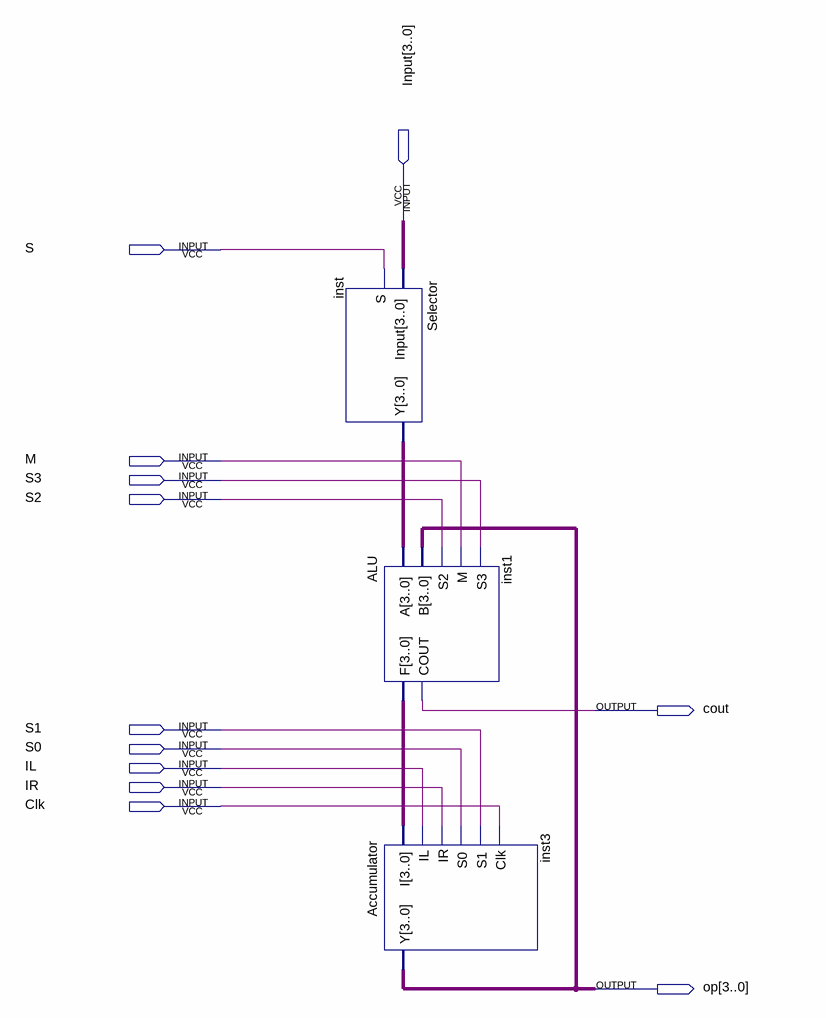
[diagram p0: schematic sheet]
// Quartus schematic Lab10.bdf as structural Verilog: 3 symbols, 12 pins
module Lab10 (
  input  [3:0] Input,
  input  S,
  input  M,
  input  S3,
  input  S2,
  input  S1,
  input  S0,
  input  IL,
  input  IR,
  input  Clk,
  output cout,
  output [3:0] op
);

  wire [3:0] inst1_f, inst_y;

  Selector inst (.Input(Input), .S(S), .Y(inst_y));
  ALU inst1 (.A(inst_y), .B(op), .S2(S2), .M(M), .S3(S3), .F(inst1_f), .COUT(cout));
  Accumulator inst3 (.I(inst1_f), .IL(IL), .IR(IR), .S0(S0), .S1(S1), .Clk(Clk), .Y(op));
endmodule
